# Altium project HM_LightSensor.PrjPcb
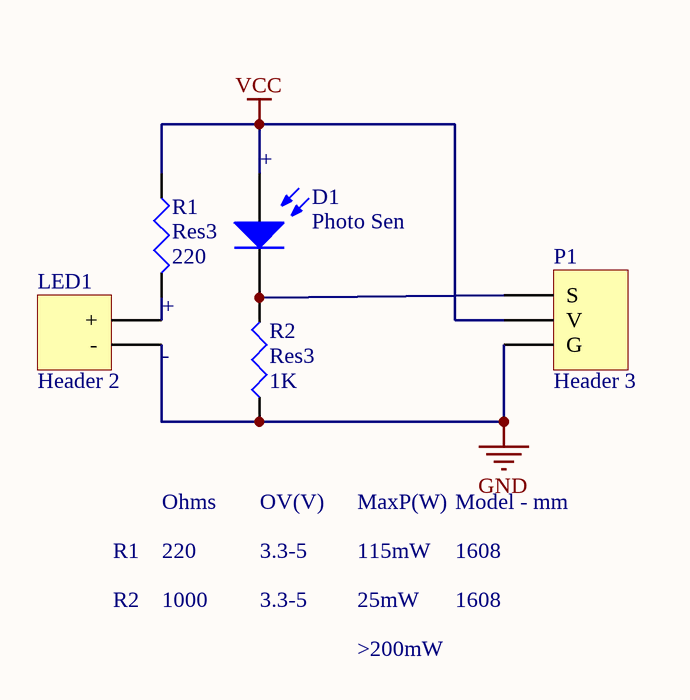
[diagram p0: HM_LightSensor.SchDoc]
1 sheet, 5 parts. Net scope: global (net labels, ports and power ports of the same name join across sheets).
Board file: HM_LightSensor.PcbDoc

## Sheet HM_LightSensor.SchDoc
size A4

### Parts
D1  Photo Sen  [PIN2]
LED1  Header 2  [HDR1X2]
P1  Header 3  [HDR1X3]
R1  Res3  value 220  [J1-0603]
R2  Res3  value 1K  [J1-0603]

### Nets
GND: LED1.1(-) P1.3(G) R2.1
VCC: D1.1(A) P1.2(V) R1.1
NetD1_2: D1.2(K) P1.1(S) R2.2
NetLED1_2: LED1.2(+) R1.2

### Notes on the sheet
- (near D1) +
- (near R1) +
- -
- R1
- R2
- 220
- 1000
- Ohms
- 3.3-5
- (near R2) OV(V)
- MaxP(W)
- 115mW
- 25mW
- Model - mm
- 1608
- >200mW

### Library data of the parts
D1 = Photo Sen: Photosensitive Diode; Published: 24-Mar-1999; LatestRevisionDate: 17-Jul-2002; LatestRevisionNote: Re-released for DXP Platform.; PackageReference: PIN2; Publisher: Altium Limited
LED1 = Header 2: Header, 2-Pin; LatestRevisionDate: 17-Jul-2002; LatestRevisionNote: Re-released for DXP Platform.; Publisher: Altium Limited
P1 = Header 3: Header, 3-Pin; LatestRevisionDate: 17-Jul-2002; LatestRevisionNote: Re-released for DXP Platform.; Publisher: Altium Limited
R1 R2 = Res3: Resistor; Published: 8-Jun-2000; LatestRevisionDate: 29-May-2009; LatestRevisionNote: IPC-7351 Footprint Added.; PackageReference: J1-0603; Publisher: Altium Limited; PackageDescription: Chip Resistor